# Altium project EmbeddedControl_Hardware_PCBProject.PrjPCB
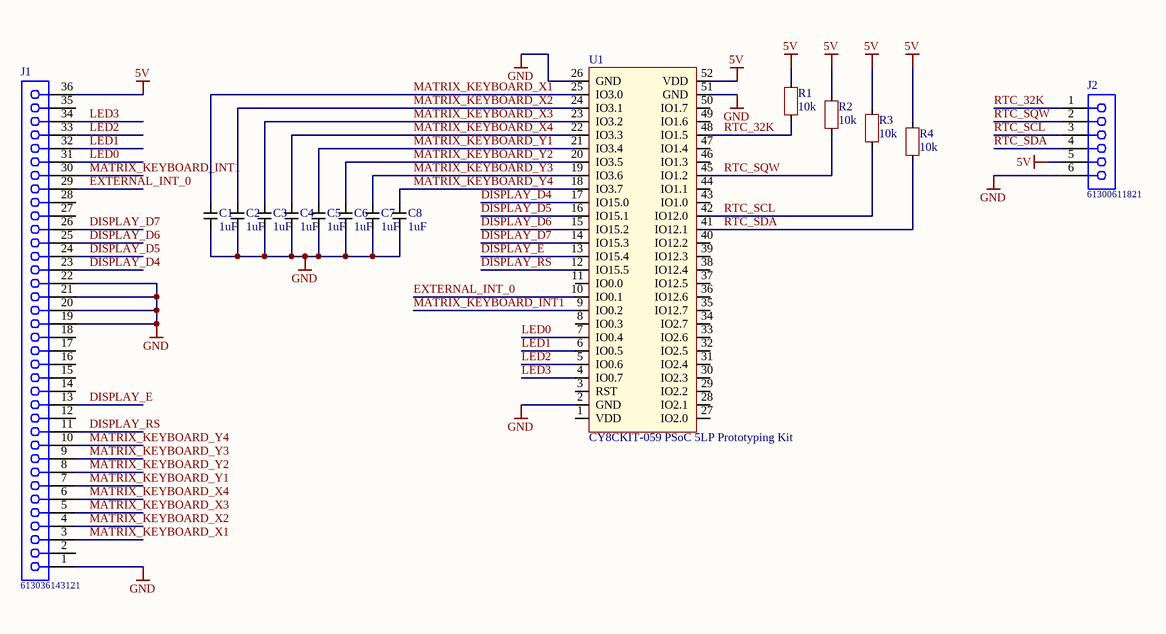
[diagram p0: main.SchDoc]
1 sheet, 15 parts. Net scope: global (net labels, ports and power ports of the same name join across sheets).
Board file: converterBoard.PcbDoc

## Sheet main.SchDoc: EmbeddedControl_Hardware
size A4; Author: Gerjan Mollema & Fredrik-Otto Lautenbag; Organization: NHLStenden; Address1: Rengerslaan 8; Address2: 8917 DD; Address3: Leeuwarden; Address4: The Netherlands; Revision: 2; SheetNumber: 1; SheetTotal: 1; Number: 1

### Parts
C1  1uF  [C1206_DEVELOPMENT]
C2  1uF  [C1206_DEVELOPMENT]
C3  1uF  [C1206_DEVELOPMENT]
C4  1uF  [C1206_DEVELOPMENT]
C5  1uF  [C1206_DEVELOPMENT]
C6  1uF  [C1206_DEVELOPMENT]
C7  1uF  [C1206_DEVELOPMENT]
C8  1uF  [C1206_DEVELOPMENT]
J1  613036143121  [613036143121]
J2  61300611821  [61300611821]
R1  10k  [R1206_DEVELOPMENT]
R2  10k  [R1206_DEVELOPMENT]
R3  10k  [R1206_DEVELOPMENT]
R4  10k  [R1206_DEVELOPMENT]
U1  CY8CKIT-059 PSoC 5LP Prototyping Kit  [CY8CKIT-059-5LP]

### Nets
5V: J1.36 J2.5 R1.2 R2.2 R3.2 R4.2 U1.52(VDD)
GND: C1.1 C2.1 C3.1 C4.1 C5.1 C6.1 C7.1 C8.1 J1.1 J1.19 J1.20 J1.21 J1.22 J2.6 U1.2(GND) U1.26(GND) U1.51(GND)
DISPLAY_D4: J1.23 U1.17(IO15.0)
DISPLAY_D5: J1.24 U1.16(IO15.1)
DISPLAY_D6: J1.25 U1.15(IO15.2)
DISPLAY_D7: J1.26 U1.14(IO15.3)
DISPLAY_E: J1.13 U1.13(IO15.4)
DISPLAY_RS: J1.11 U1.12(IO15.5)
EXTERNAL_INT_0: J1.29 U1.10(IO0.1)
LED0: J1.31 U1.7(IO0.4)
LED1: J1.32 U1.6(IO0.5)
LED2: J1.33 U1.5(IO0.6)
LED3: J1.34 U1.4(IO0.7)
MATRIX_KEYBOARD_INT1: J1.30 U1.9(IO0.2)
MATRIX_KEYBOARD_X1: C1.2 J1.3 U1.25(IO3.0)
MATRIX_KEYBOARD_X2: C2.2 J1.4 U1.24(IO3.1)
MATRIX_KEYBOARD_X3: C3.2 J1.5 U1.23(IO3.2)
MATRIX_KEYBOARD_X4: C4.2 J1.6 U1.22(IO3.3)
MATRIX_KEYBOARD_Y1: C5.2 J1.7 U1.21(IO3.4)
MATRIX_KEYBOARD_Y2: C6.2 J1.8 U1.20(IO3.5)
MATRIX_KEYBOARD_Y3: C7.2 J1.9 U1.19(IO3.6)
MATRIX_KEYBOARD_Y4: C8.2 J1.10 U1.18(IO3.7)
RTC_32K: J2.1 R1.1 U1.48(IO1.5)
RTC_SCL: J2.3 R3.1 U1.42(IO12.0)
RTC_SDA: J2.4 R4.1 U1.41(IO12.1)
RTC_SQW: J2.2 R2.1 U1.45(IO1.2)

Not connected (* = marked no-connect by the designer): J1 2 12 14 15 16 17(0) 18(0) 27(0) 28(0) 35(0); U1 1(VDD) 3(RST) 8(IO0.3) 11(IO0.0) 27(IO2.0) 28(IO2.1) 29(IO2.2) 30(IO2.3) 31(IO2.4) 32(IO2.5) 33(IO2.6) 34(IO2.7) 35(IO12.7) 36(IO12.6) 37(IO12.5) 38(IO12.4) 39(IO12.3) 40(IO12.2) 43(IO1.0) 44(IO1.1) 46(IO1.3) 47(IO1.4) 49(IO1.6) 50(IO1.7)

### Notes on the sheet
- Title
- Size:
- Date:
- A4
- Author(s):
- Time:
- Sheet
- of
- Revision:
- File:

### Library data of the parts
C1-C8 = 1uF,1206: SMD Multilayer Ceramic Capacitor, 1 µF, 16 V, 1206 [3216 Metric], +80%, -20%, Y5V, C Series KEMET; Type: C1206C105Z4VACTU; Capacitance: 1uF; Brand: KEMET; Ordercode_Farnell: 2773306; Price_Farnell: 0,077; Ordercode_Digi-Key: 399-9308-1-ND; Price_Digi-Key: 0,137
J1 = 613036143121: Brand: WURTH ELEKTRONIK; Type: 613036143121
J2 = 61300611821: THT Vertical Socket Header WR-PHD, Pitch 2.54 mm, Single Row, 6 pins; Brand: Wurth Elektronik; Pin Number: 6; Pitch: 2.54 mm; Gender: Female; Rated Current: 3 A; Working Voltage: 250 VAC; Withstanding Voltage: 500 VAC; Contact Resistance: 20 mOhm; ComponentLink1Description: Manufacturer; ComponentLink1URL: http://www.we-online.de; ComponentLink2Description: Datasheet; ComponentLink2URL: https://katalog.we-online.de/em/datasheet/6130xx11821.pdf; Type: 61300611821; Published Date: August 2018; Operating Temperature: -40 to 125 degC; Mounting Technology: THT; Packaging: Tray; Row Number: Single; Orientation: Vertical
R1-R4 = 10k, 1206: 10k, 1206, 250mW, 200V; Brand: BOURNS; Ordercode_Farnell: 2008395; Resistance: 10k; Power: 250mW; Type: CR1206-FX-1002ELF; Price_Farnell: 0,0217; Ordercode_Digi-Key: CR1206-FX-1002ELFCT-ND; Price_Digi-Key: 0,08